# EAGLE schematic score_anzeige (EAGLE 9.0.1)
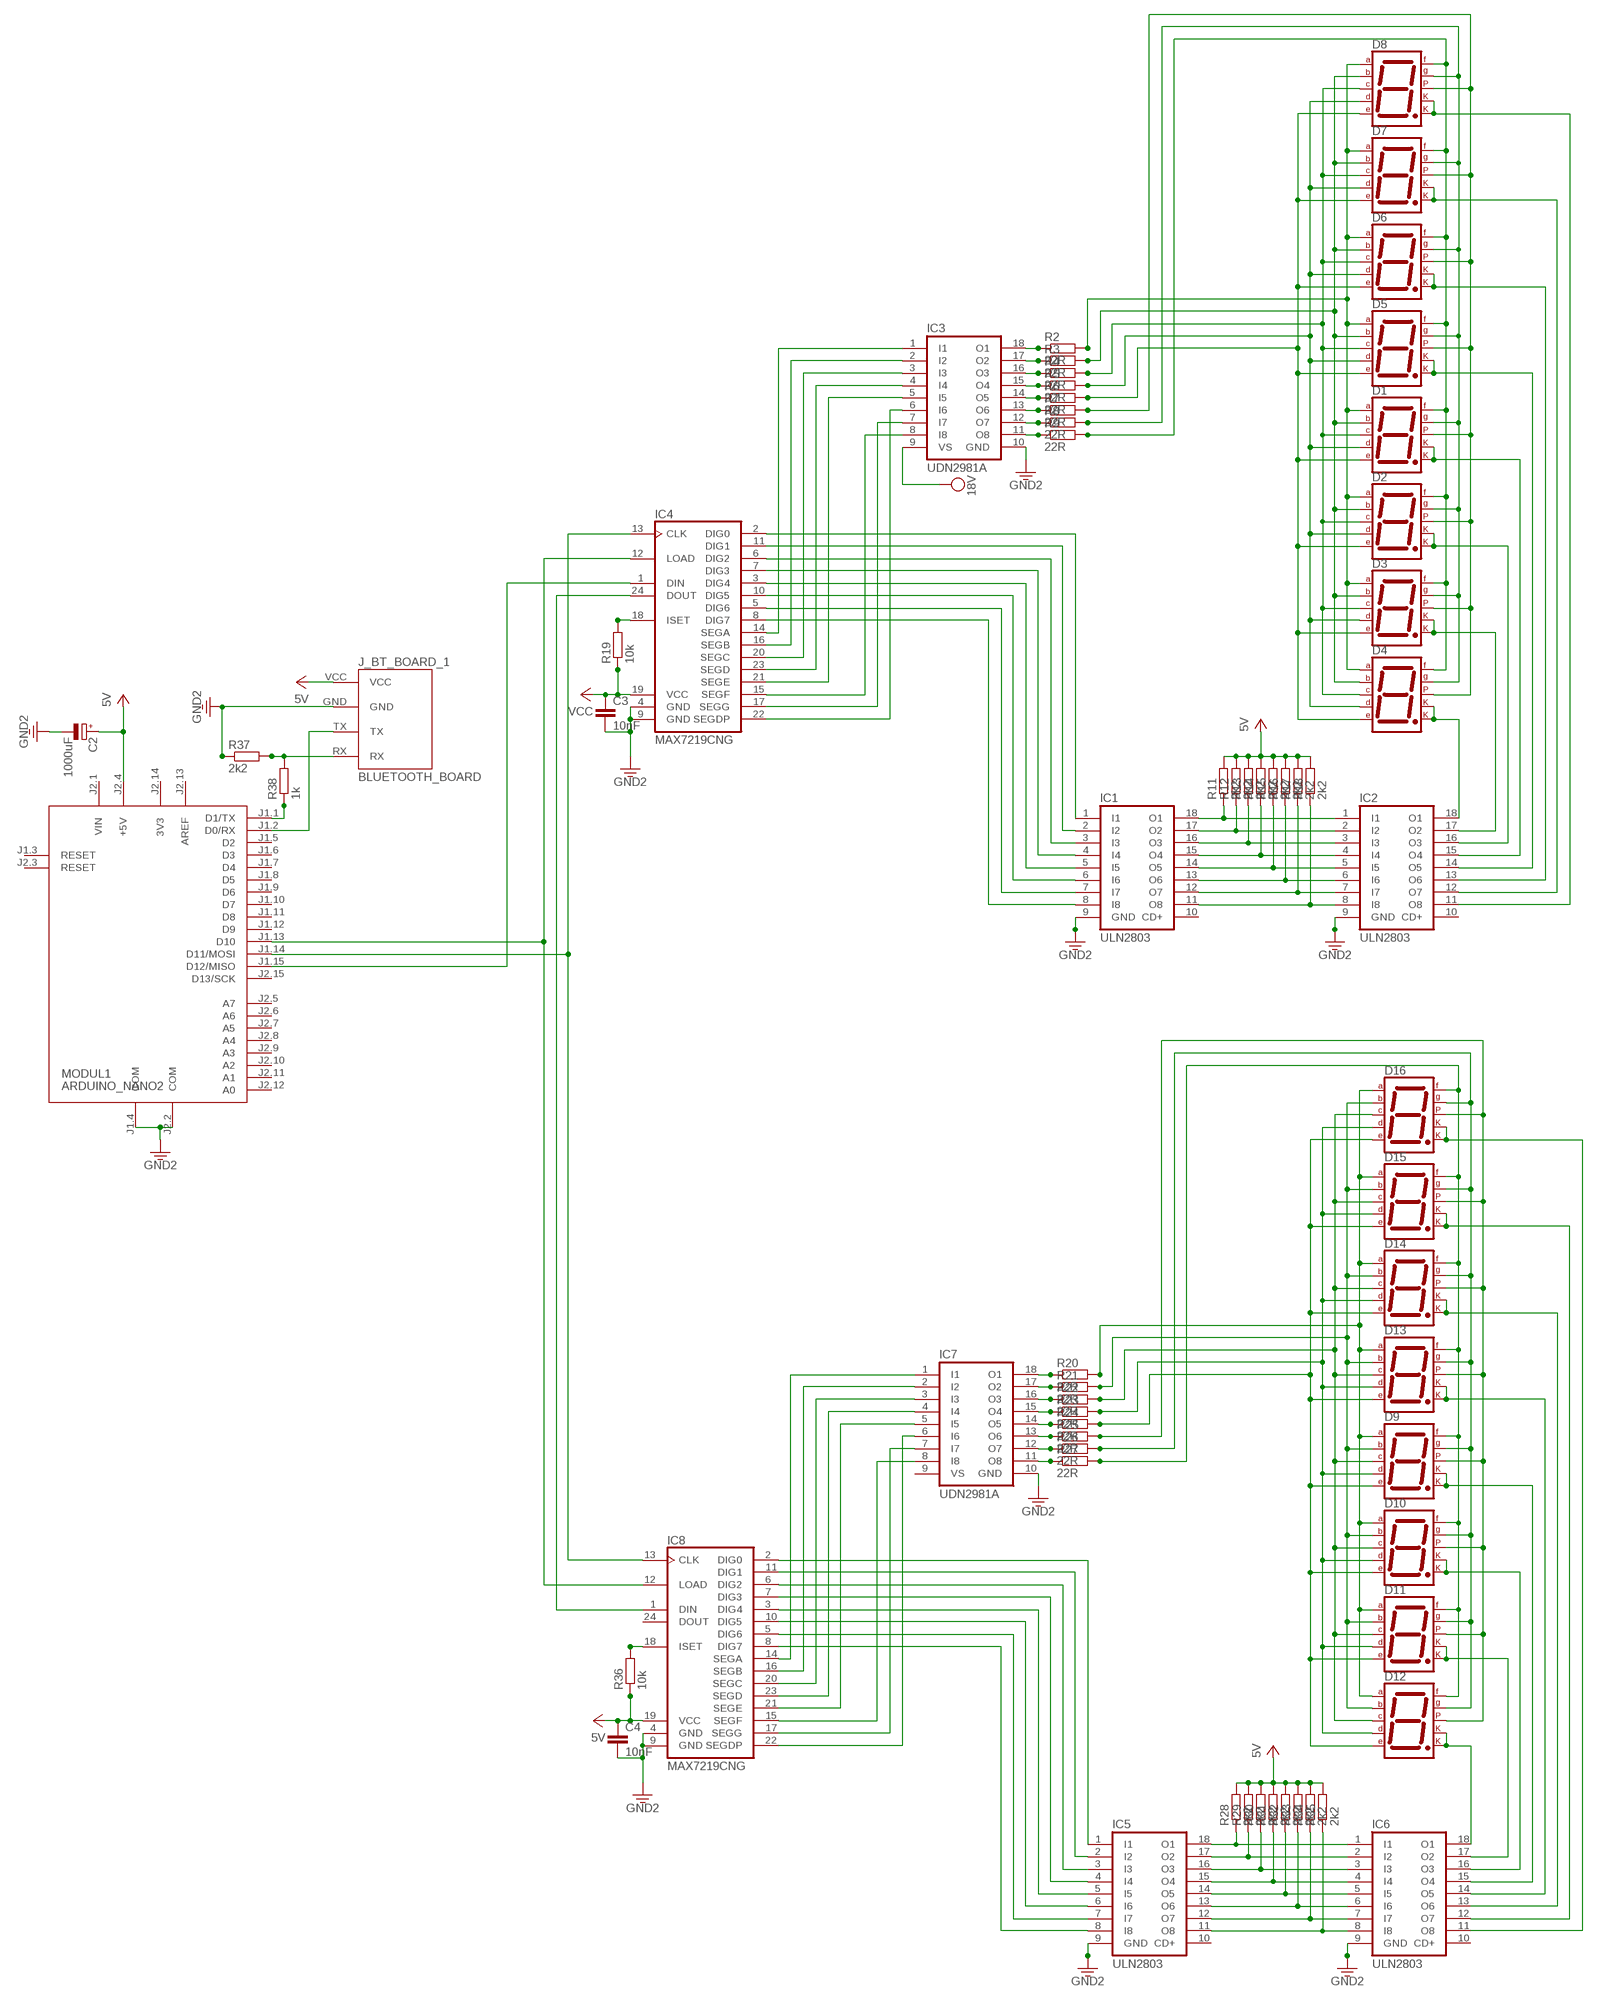
[diagram p0: schematic, sheet 1]

## Parts
C2  1000uF  CPOL-EUE5-10.5  [E5-10,5]
C3  10nF  C-EU025-025X050  [C025-025X050]
C4  10nF  C-EU025-025X050  [C025-025X050]
D1  7SEG-MCK  [7SEG-7]
D2  7SEG-MCK  [7SEG-7]
D3  7SEG-MCK  [7SEG-7]
D4  7SEG-MCK  [7SEG-7]
D5  7SEG-MCK  [7SEG-7]
D6  7SEG-MCK  [7SEG-7]
D7  7SEG-MCK  [7SEG-7]
D8  7SEG-MCK  [7SEG-7]
D9  7SEG-MCK  [7SEG-7]
D10  7SEG-MCK  [7SEG-7]
D11  7SEG-MCK  [7SEG-7]
D12  7SEG-MCK  [7SEG-7]
D13  7SEG-MCK  [7SEG-7]
D14  7SEG-MCK  [7SEG-7]
D15  7SEG-MCK  [7SEG-7]
D16  7SEG-MCK  [7SEG-7]
IC1  ULN2803  ULN2803A  [DIL18]
IC2  ULN2803  ULN2803A  [DIL18]
IC3  UDN2981A  [DIL18]
IC4  MAX7219CNG  [DIL24-3]
IC5  ULN2803  ULN2803A  [DIL18]
IC6  ULN2803  ULN2803A  [DIL18]
IC7  UDN2981A  [DIL18]
IC8  MAX7219CNG  [DIL24-3]
J_BT_BOARD_1  BLUETOOTH_BOARD  [BT_BOARD_FOOTPRINT]
MODUL1  ARDUINO_NANO2  [ARDUINO_NANO2]
R2  22R  R-EU_0204/7  [0204/7]
R3  22R  R-EU_0204/7  [0204/7]
R4  22R  R-EU_0204/7  [0204/7]
R5  22R  R-EU_0204/7  [0204/7]
R6  22R  R-EU_0204/7  [0204/7]
R7  22R  R-EU_0204/7  [0204/7]
R8  22R  R-EU_0204/7  [0204/7]
R9  22R  R-EU_0204/7  [0204/7]
R11  2k2  R-EU_0204/7  [0204/7]
R12  2k2  R-EU_0204/7  [0204/7]
R13  2k2  R-EU_0204/7  [0204/7]
R14  2k2  R-EU_0204/7  [0204/7]
R15  2k2  R-EU_0204/7  [0204/7]
R16  2k2  R-EU_0204/7  [0204/7]
R17  2k2  R-EU_0204/7  [0204/7]
R18  2k2  R-EU_0204/7  [0204/7]
R19  10k  R-EU_0204/7  [0204/7]
R20  22R  R-EU_0204/7  [0204/7]
R21  22R  R-EU_0204/7  [0204/7]
R22  22R  R-EU_0204/7  [0204/7]
R23  22R  R-EU_0204/7  [0204/7]
R24  22R  R-EU_0204/7  [0204/7]
R25  22R  R-EU_0204/7  [0204/7]
R26  22R  R-EU_0204/7  [0204/7]
R27  22R  R-EU_0204/7  [0204/7]
R28  2k2  R-EU_0204/7  [0204/7]
R29  2k2  R-EU_0204/7  [0204/7]
R30  2k2  R-EU_0204/7  [0204/7]
R31  2k2  R-EU_0204/7  [0204/7]
R32  2k2  R-EU_0204/7  [0204/7]
R33  2k2  R-EU_0204/7  [0204/7]
R34  2k2  R-EU_0204/7  [0204/7]
R35  2k2  R-EU_0204/7  [0204/7]
R36  10k  R-EU_0204/7  [0204/7]
R37  2k2  R-EU_0204/7  [0204/7]
R38  1k  R-EU_0204/7  [0204/7]

## Nets
3.3V: C2.- C3.2 C4.2 IC1.9(GND) IC2.9(GND) IC3.10(GND) IC4.4(GND) IC4.9(GND) IC5.9(GND) IC6.9(GND) IC7.10(GND) IC8.4(GND) IC8.9(GND) J_BT_BOARD_1.GND MODUL1.J1.4(COM) MODUL1.J2.2(COM) R37.1 ; supply symbol labelled GND2
N$1: IC1.18(O1) IC2.1(I1) R11.1
N$2: IC1.17(O2) IC2.2(I2) R12.1
N$3: IC1.16(O3) IC2.3(I3) R13.1
N$4: IC1.15(O4) IC2.4(I4) R14.1
N$5: IC1.14(O5) IC2.5(I5) R15.1
N$6: IC1.13(O6) IC2.6(I6) R16.1
N$7: IC1.12(O7) IC2.7(I7) R17.1
N$8: IC1.11(O8) IC2.8(I8) R18.1
N$9: D4.1(CK1) D4.6(CK2) IC2.18(O1)
N$10: D3.1(CK1) D3.6(CK2) IC2.17(O2)
N$11: D2.1(CK1) D2.6(CK2) IC2.16(O3)
N$12: D1.1(CK1) D1.6(CK2) IC2.15(O4)
N$13: IC3.18(O1) R2.1
N$14: IC3.17(O2) R3.1
N$15: IC3.16(O3) R4.1
N$16: D5.1(CK1) D5.6(CK2) IC2.14(O5)
N$17: D6.1(CK1) D6.6(CK2) IC2.13(O6)
N$18: D7.1(CK1) D7.6(CK2) IC2.12(O7)
N$19: D8.1(CK1) D8.6(CK2) IC2.11(O8)
N$20: IC3.15(O4) R5.1
N$21: IC3.14(O5) R6.1
N$22: D1.10(A) D2.10(A) D3.10(A) D4.10(A) D5.10(A) D6.10(A) D7.10(A) D8.10(A) R2.2
N$23: IC3.13(O6) R7.1
N$24: IC3.12(O7) R8.1
N$25: IC3.11(O8) R9.1
N$26: D1.9(B) D2.9(B) D3.9(B) D4.9(B) D5.9(B) D6.9(B) D7.9(B) D8.9(B) R3.2
N$27: D1.8(C) D2.8(C) D3.8(C) D4.8(C) D5.8(C) D6.8(C) D7.8(C) D8.8(C) R4.2
N$28: D1.5(D) D2.5(D) D3.5(D) D4.5(D) D5.5(D) D6.5(D) D7.5(D) D8.5(D) R5.2
N$29: D1.4(E) D2.4(E) D3.4(E) D4.4(E) D5.4(E) D6.4(E) D7.4(E) D8.4(E) R6.2
N$30: D1.7(DP) D2.7(DP) D3.7(DP) D4.7(DP) D5.7(DP) D6.7(DP) D7.7(DP) D8.7(DP) R7.2
N$31: IC1.1(I1) IC4.2(DIG0)
N$32: D1.2(F) D2.2(F) D3.2(F) D4.2(F) D5.2(F) D6.2(F) D7.2(F) D8.2(F) R9.2
N$33: D1.3(G) D2.3(G) D3.3(G) D4.3(G) D5.3(G) D6.3(G) D7.3(G) D8.3(G) R8.2
N$34: IC1.2(I2) IC4.11(DIG1)
N$35: IC1.3(I3) IC4.6(DIG2)
N$36: IC1.4(I4) IC4.7(DIG3)
N$37: IC1.5(I5) IC4.3(DIG4)
N$38: IC1.6(I6) IC4.10(DIG5)
N$39: IC1.7(I7) IC4.5(DIG6)
N$40: IC1.8(I8) IC4.8(DIG7)
N$41: IC3.1(I1) IC4.14(SEGA)
N$42: IC3.2(I2) IC4.16(SEGB)
N$43: IC3.3(I3) IC4.20(SEGC)
N$44: IC3.4(I4) IC4.23(SEGD)
N$45: IC3.5(I5) IC4.21(SEGE)
N$46: IC3.6(I6) IC4.22(SEGDP)
N$47: IC3.7(I7) IC4.17(SEGG)
N$48: IC3.8(I8) IC4.15(SEGF)
N$49: MODUL1.J1.1(D1/TX) R38.1
N$50: IC4.18(ISET) R19.2
N$51: IC5.18(O1) IC6.1(I1) R28.1
N$52: IC5.17(O2) IC6.2(I2) R29.1
N$53: IC5.16(O3) IC6.3(I3) R30.1
N$54: IC5.15(O4) IC6.4(I4) R31.1
N$55: IC5.14(O5) IC6.5(I5) R32.1
N$56: IC5.13(O6) IC6.6(I6) R33.1
N$57: IC5.12(O7) IC6.7(I7) R34.1
N$58: IC5.11(O8) IC6.8(I8) R35.1
N$59: D12.1(CK1) D12.6(CK2) IC6.18(O1)
N$60: D11.1(CK1) D11.6(CK2) IC6.17(O2)
N$61: D10.1(CK1) D10.6(CK2) IC6.16(O3)
N$62: D9.1(CK1) D9.6(CK2) IC6.15(O4)
N$63: D13.1(CK1) D13.6(CK2) IC6.14(O5)
N$64: D14.1(CK1) D14.6(CK2) IC6.13(O6)
N$65: D15.1(CK1) D15.6(CK2) IC6.12(O7)
N$66: D16.1(CK1) D16.6(CK2) IC6.11(O8)
N$67: D9.10(A) D10.10(A) D11.10(A) D12.10(A) D13.10(A) D14.10(A) D15.10(A) D16.10(A) R20.2
N$68: IC7.18(O1) R20.1
N$69: IC7.17(O2) R21.1
N$70: IC7.16(O3) R22.1
N$71: IC7.15(O4) R23.1
N$72: IC7.14(O5) R24.1
N$73: IC7.13(O6) R25.1
N$74: IC7.12(O7) R26.1
N$75: IC7.11(O8) R27.1
N$76: D9.9(B) D10.9(B) D11.9(B) D12.9(B) D13.9(B) D14.9(B) D15.9(B) D16.9(B) R21.2
N$77: D9.8(C) D10.8(C) D11.8(C) D12.8(C) D13.8(C) D14.8(C) D15.8(C) D16.8(C) R22.2
N$78: D9.5(D) D10.5(D) D11.5(D) D12.5(D) D13.5(D) D14.5(D) D15.5(D) D16.5(D) R23.2
N$79: D9.4(E) D10.4(E) D11.4(E) D12.4(E) D13.4(E) D14.4(E) D15.4(E) D16.4(E) R24.2
N$80: D9.2(F) D10.2(F) D11.2(F) D12.2(F) D13.2(F) D14.2(F) D15.2(F) D16.2(F) R27.2
N$81: D9.3(G) D10.3(G) D11.3(G) D12.3(G) D13.3(G) D14.3(G) D15.3(G) D16.3(G) R26.2
N$82: D9.7(DP) D10.7(DP) D11.7(DP) D12.7(DP) D13.7(DP) D14.7(DP) D15.7(DP) D16.7(DP) R25.2
N$83: IC5.1(I1) IC8.2(DIG0)
N$84: IC5.2(I2) IC8.11(DIG1)
N$85: IC5.3(I3) IC8.6(DIG2)
N$86: IC5.4(I4) IC8.7(DIG3)
N$87: IC5.5(I5) IC8.3(DIG4)
N$88: IC5.6(I6) IC8.10(DIG5)
N$89: IC5.7(I7) IC8.5(DIG6)
N$90: IC5.8(I8) IC8.8(DIG7)
N$91: IC7.1(I1) IC8.14(SEGA)
N$92: IC7.2(I2) IC8.16(SEGB)
N$93: IC7.3(I3) IC8.20(SEGC)
N$94: IC7.4(I4) IC8.23(SEGD)
N$95: IC7.5(I5) IC8.21(SEGE)
N$96: IC7.6(I6) IC8.22(SEGDP)
N$97: IC7.7(I7) IC8.17(SEGG)
N$98: IC7.8(I8) IC8.15(SEGF)
N$99: IC8.18(ISET) R36.2
N$100: IC4.24(DOUT) IC8.1(DIN)
N$101: IC4.13(CLK) IC8.13(CLK) MODUL1.J1.14(D11/MOSI)
N$102: IC4.12(LOAD) IC8.12(LOAD) MODUL1.J1.13(D10)
N$103: IC4.1(DIN) MODUL1.J1.15(D12/MISO)
N$104: J_BT_BOARD_1.TX MODUL1.J1.2(D0/RX)
N$105: J_BT_BOARD_1.RX R37.2 R38.2
VCC: C2.+ C3.1 C4.1 IC3.9(VS) IC4.19(VCC) IC8.19(VCC) J_BT_BOARD_1.VCC MODUL1.J2.4(+5V) R11.2 R12.2 R13.2 R14.2 R15.2 R16.2 R17.2 R18.2 R19.1 R28.2 R29.2 R30.2 R31.2 R32.2 R33.2 R34.2 R35.2 R36.1 ; supply symbol labelled 5V, 18V
Unconnected: IC1.10(CD+) IC2.10(CD+) IC5.10(CD+) IC6.10(CD+) IC7.9(VS) IC8.24(DOUT) MODUL1.J1.3(RESET) MODUL1.J1.5(D2) MODUL1.J1.6(D3) MODUL1.J1.7(D4) MODUL1.J1.8(D5) MODUL1.J1.9(D6) MODUL1.J1.10(D7) MODUL1.J1.11(D8) MODUL1.J1.12(D9) MODUL1.J2.3(RESET) MODUL1.J2.5(A7) MODUL1.J2.6(A6) MODUL1.J2.7(A5) MODUL1.J2.8(A4) MODUL1.J2.9(A3) MODUL1.J2.10(A2) MODUL1.J2.11(A1) MODUL1.J2.12(A0) MODUL1.J2.15(D13/SCK)

## Power pins joined to a net without a drawn wire
3V3: MODUL1.J2.14(3V3)
AREF: MODUL1.J2.13(AREF)
VIN: MODUL1.J2.1(VIN)

## Library data of the parts
C2 = resistor:CPOL-EU: POLARIZED CAPACITOR, European symbol
C3 C4 = resistor:C-EU: CAPACITOR, European symbol
D1-D16 = special:7SEG-MCK: 7-segment DISPLAY single cathode, 13 mm
IC1 IC2 IC5 IC6 = uln-udn:ULN2803A: DRIVER ARRAY
IC3 IC7 = uln-udn:UDN298*: DRIVER ARRAY Source: Allegro Microsystems Inc. / UDN2981-UDN2984.pdf
IC4 IC8 = maxim:MAX7219CNG: LED DISPLAY DRIVER; MF: MAXIM; MPN: MAX7219CNG; OC_FARNELL: 1523914; OC_NEWARK: 34C4018
J_BT_BOARD_1 = Bluetooth HC-05:BLUETOOTH_BOARD: Bluetooth Board V1.05
MODUL1 = arduino:ARDUINO_NANO2: Arduino Nano2 Auto generated by modulcreator.ulp \;; ANZAHL: 2; MODUL: TRUE; STECKX0: -76200; STECKX1: 76200; STECKY0: 177800; STECKY1: 177800
R2-R9 R11-R38 = resistor:R-EU_: RESISTOR, European symbol